# EAGLE schematic power electronics4 (EAGLE 9.2.2)
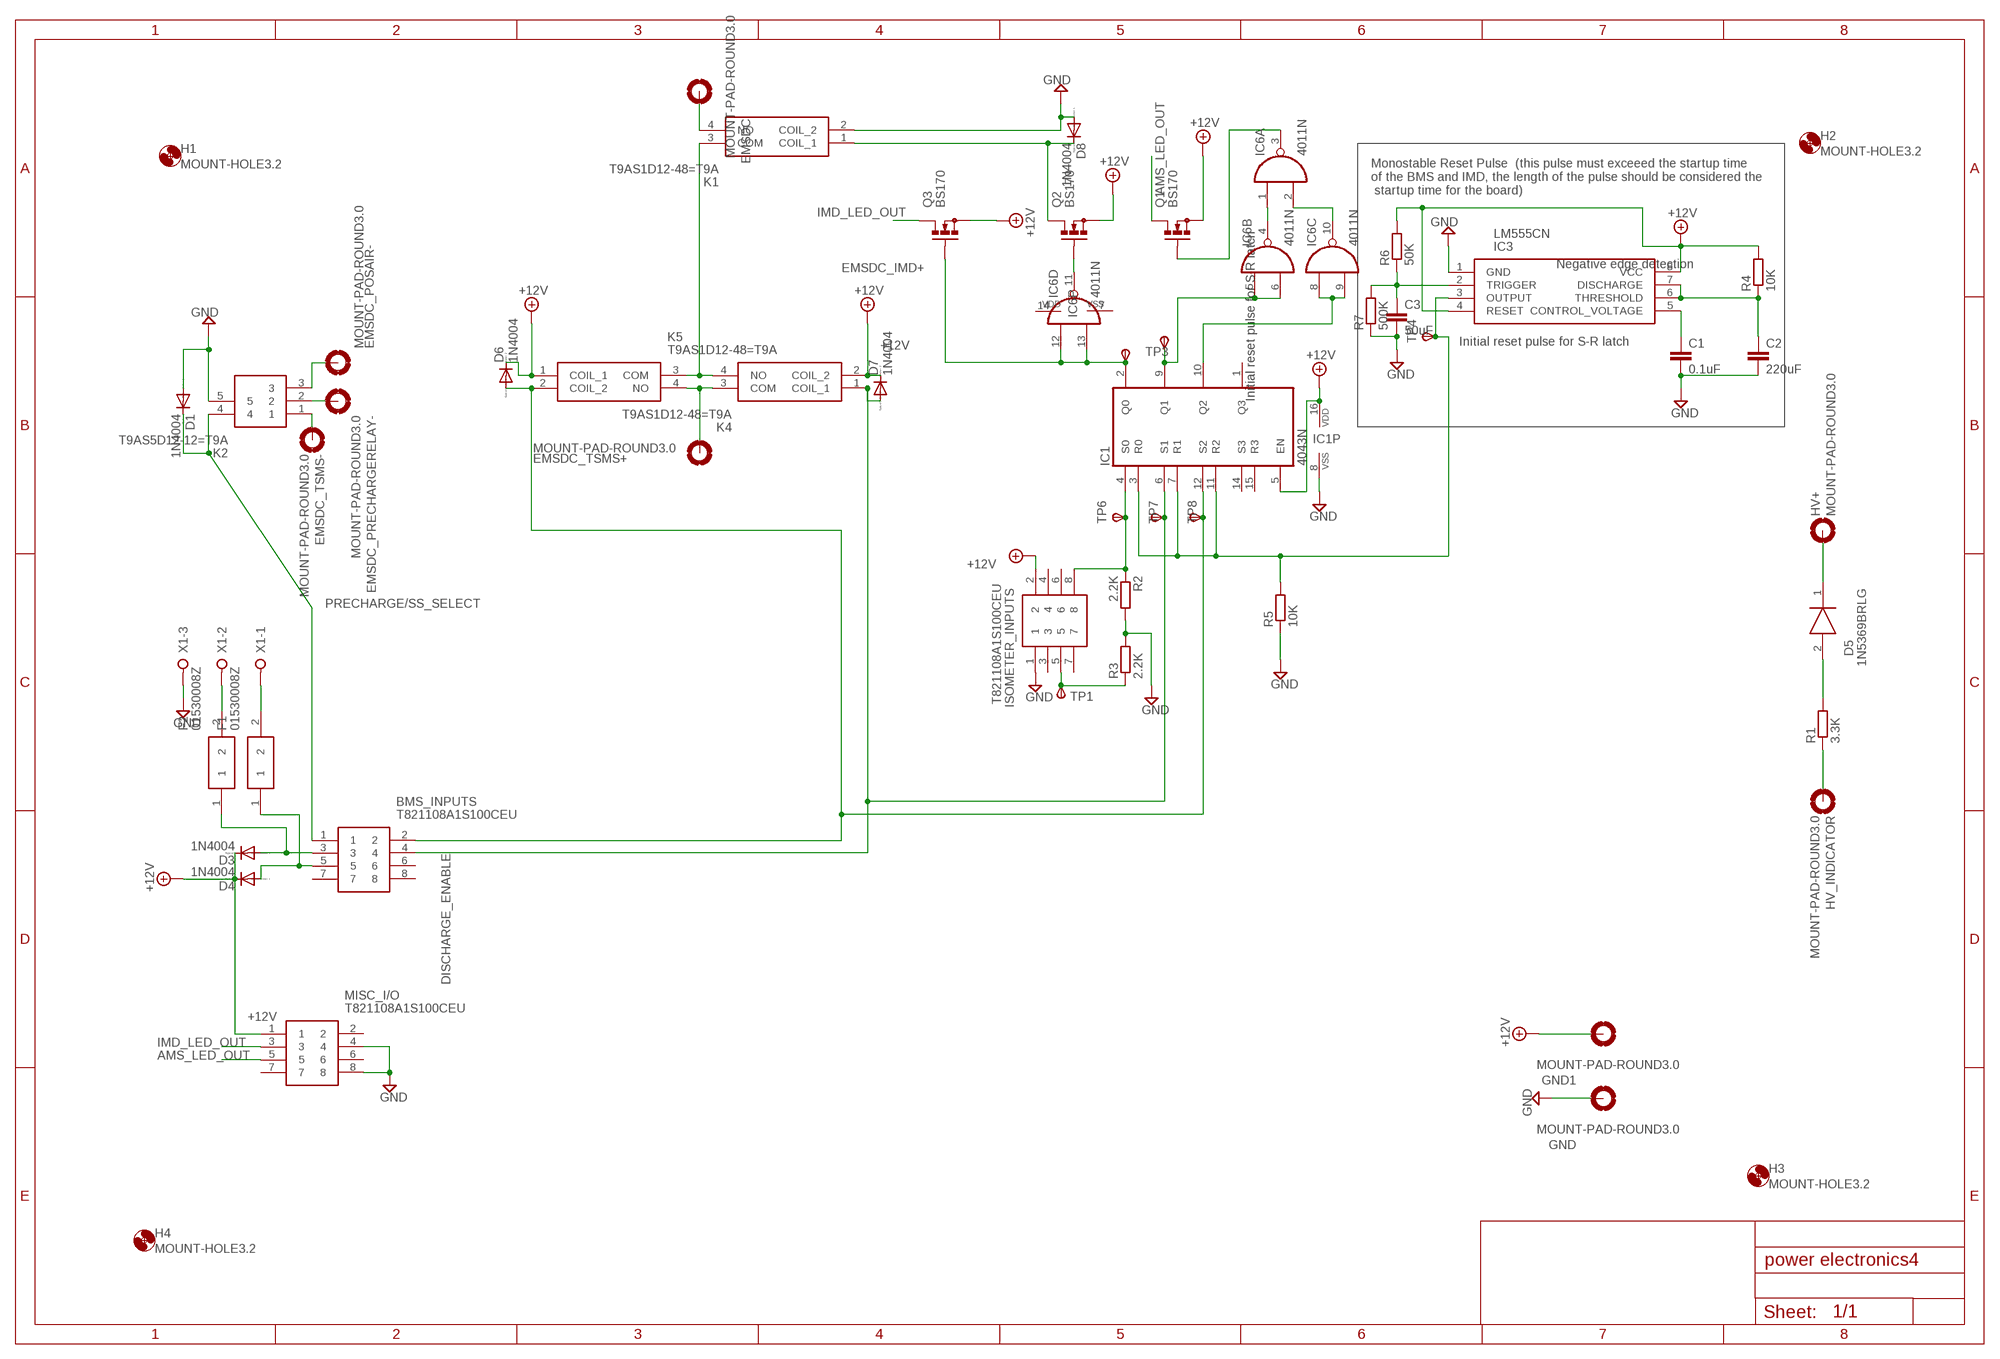
[diagram p0: schematic, sheet 1]

## Parts
BMS_INPUTS  T821108A1S100CEU  [HDRV8W64P254_2X4_1778X895X915P]
C1  0.1uF  C-EU050-024X044  [C050-024X044]
C2  220uF  C-EU050-024X044  [C050-024X044]
C3  50uF  C-EU050-024X044  [C050-024X044]
D1  1N4004  [DO41-10]
D3  1N4004  [DO41-10]
D4  1N4004  [DO41-10]
D5  1N5369BRLG  [DIOAD2260W109L864D349]
D6  1N4004  [DO41-10]
D7  1N4004  [DO41-10]
D8  1N4004  [DO41-10]
EMSDC  MOUNT-PAD-ROUND3.0  [3,0-PAD]
EMSDC_POSAIR-  MOUNT-PAD-ROUND3.0  [3,0-PAD]
EMSDC_PRECHARGERELAY-  MOUNT-PAD-ROUND3.0  [3,0-PAD]
EMSDC_TSMS+  MOUNT-PAD-ROUND3.0  [3,0-PAD]
EMSDC_TSMS-  MOUNT-PAD-ROUND3.0  [3,0-PAD]
F1  01530008Z  [01530008]
F2  01530008Z  [01530008]
GND  MOUNT-PAD-ROUND3.0  [3,0-PAD]
GND1  MOUNT-PAD-ROUND3.0  [3,0-PAD]
H1  MOUNT-HOLE3.2  [3,2]
H2  MOUNT-HOLE3.2  [3,2]
H3  MOUNT-HOLE3.2  [3,2]
H4  MOUNT-HOLE3.2  [3,2]
HV+  MOUNT-PAD-ROUND3.0  [3,0-PAD]
HV_INDICATOR  MOUNT-PAD-ROUND3.0  [3,0-PAD]
IC1  4043N  [DIL16]
IC3  LM555CN  [DIP762W53P254L980H533Q8N]
IC6  4011N  [DIL14]
ISOMETER_INPUTS  T821108A1S100CEU  [HDRV8W64P254_2X4_1778X895X915P]
K1  T9AS1D12-48=T9A  [T9AS1D1248T9A]
K2  T9AS5D12-12=T9A  [T9AS1D12]
K4  T9AS1D12-48=T9A  [T9AS1D1248T9A]
K5  T9AS1D12-48=T9A  [T9AS1D1248T9A]
MISC_I/O  T821108A1S100CEU  [HDRV8W64P254_2X4_1778X895X915P]
Q1  BS170  [SOT54E]
Q2  BS170  [SOT54E]
Q3  BS170  [SOT54E]
R1  3.3K  R-EU_0207/15  [0207/15]
R2  2.2K  R-EU_0207/12  [0207/12]
R3  2.2K  R-EU_0207/12  [0207/12]
R4  10K  R-EU_0207/15  [0207/15]
R5  10K  R-EU_0207/15  [0207/15]
R6  50K  R-EU_0207/15  [0207/15]
R7  500K  R-EU_0207/15  [0207/15]
TP1  TPSPAD1-17  [P1-17]
TP2  TPSPAD1-17  [P1-17]
TP3  TPSPAD1-17  [P1-17]
TP4  TPSPAD1-17  [P1-17]
TP6  TPSPAD1-17  [P1-17]
TP7  TPSPAD1-17  [P1-17]
TP8  TPSPAD1-17  [P1-17]
X1  W237-3E  [W237-3E]

## Nets
+12V: D3.C D4.C D6.C D7.C GND1.B3,0(MOUNT) IC1.5(EN) IC1.16(VDD) IC3.4(RESET) IC3.8(VCC) ISOMETER_INPUTS.2 K4.2(COIL_2) K5.1(COIL_1) MISC_I/O.1 Q1.S Q2.S Q3.S R4.2 R6.2
AMS_LED_OUT: MISC_I/O.5 Q1.D
CHG_SAFE: BMS_INPUTS.2 D6.A IC1.12(S2) K5.2(COIL_2) TP8.TP(PP)
DISCHARGE_ENABLE: BMS_INPUTS.4 D7.A IC1.6(S1) K4.1(COIL_1) TP7.TP(PP)
EMSDC_IMD+: K1.3(COM) K4.4(NO) K5.3(COM)
GND: C1.2 C2.2 C3.2 D1.A D8.A GND.B3,0(MOUNT) IC1.8(VSS) IC3.1(GND) ISOMETER_INPUTS.1 K1.2(COIL_2) K2.5 MISC_I/O.4 MISC_I/O.8 R2.2 R3.2 R5.1 R7.1 X1.3
IMD_LED_OUT: MISC_I/O.3 Q3.D
N$1: EMSDC_TSMS-.B3,0(MOUNT) K2.1
N$2: EMSDC_POSAIR-.B3,0(MOUNT) K2.3
N$3: EMSDC_PRECHARGERELAY-.B3,0(MOUNT) K2.2
N$4: EMSDC_TSMS+.B3,0(MOUNT) K4.3(COM) K5.4(NO)
N$5: D5.1(K) HV+.B3,0(MOUNT)
N$6: BMS_INPUTS.3 D3.A F2.1
N$7: D5.2(A) R1.2
N$8: BMS_INPUTS.5 D4.A F1.1
N$9: HV_INDICATOR.B3,0(MOUNT) R1.1
N$10: ISOMETER_INPUTS.5 R3.1 TP1.TP(PP)
N$11: IC1.3(R0) IC1.7(R1) IC1.11(R2) IC3.3(OUTPUT) R5.2 TP4.TP(PP)
N$12: IC1.9(Q1) IC6.5(B:I0) IC6.6(B:I1) TP3.TP(PP)
N$13: IC1.10(Q2) IC6.8(C:I0) IC6.9(C:I1)
N$14: IC6.1(A:I0) IC6.4(B:O)
N$15: D8.C K1.1(COIL_1) Q2.D
N$16: EMSDC.B3,0(MOUNT) K1.4(NO)
N$17: IC1.4(S0) ISOMETER_INPUTS.8 R2.1 TP6.TP(PP)
N$18: C2.1 IC3.6(THRESHOLD) IC3.7(DISCHARGE) R4.1
N$19: C1.1 IC3.5(CONTROL_VOLTAGE)
N$20: IC6.2(A:I1) IC6.10(C:O)
N$21: IC6.3(A:O) Q1.G
N$22: C3.1 IC3.2(TRIGGER) R6.1 R7.2
N$31: F2.2 X1.2
N$33: F1.2 X1.1
N$35: IC1.2(Q0) IC6.12(D:I0) IC6.13(D:I1) Q3.G TP2.TP(PP)
N$37: IC6.11(D:O) Q2.G
PRECHARGE/SS_SELECT: BMS_INPUTS.1 D1.C K2.4
Unconnected: BMS_INPUTS.6 BMS_INPUTS.7 BMS_INPUTS.8 IC1.1(Q3) IC1.14(S3) IC1.15(R3) ISOMETER_INPUTS.3 ISOMETER_INPUTS.4 ISOMETER_INPUTS.6 ISOMETER_INPUTS.7 MISC_I/O.2 MISC_I/O.6 MISC_I/O.7

## Notes on the sheet
- Monostable Reset Pulse  (this pulse must exceeed the startup time 
  of the BMS and IMD, the length of the pulse should be considered the
   startup time for the board)
- Negative edge detection
- Initial reset pulse for S-R latch
- Initial reset pulse for S-R latch

## Power pins joined to a net without a drawn wire
VDD: IC6.14(P:VDD)
VSS: IC6.7(P:VSS)

## Library data of the parts
BMS_INPUTS ISOMETER_INPUTS MISC_I/O = SamacSys_Parts:T821108A1S100CEU: HEADER, VERTICAL, 2.54MM, 8WAY Amphenol T821 Series, 2.54mm Pitch 8 Way 2 Row Straight PCB Header, Solder Termination, 3A Source: Datasheet <http://uk.rs-online.com/web/p/products/8323569>; DESCRIPTION: HEADER, VERTICAL, 2.54MM, 8WAY Amphenol T821 Series, 2.54mm Pitch 8 Way 2 Row Straight PCB Header, Solder Termination, 3A; HEIGHT: 9.15mm; MANUFACTURER_NAME: Amphenol; MANUFACTURER_PART_NUMBER: T821108A1S100CEU; RS_PART_NUMBER: 8323569; RS_PRICE-STOCK: http://uk.rs-online.com/web/p/products/8323569
C1-C3 = rcl:C-EU: CAPACITOR, European symbol; SPICEPREFIX: C
D1 D3 D4 D6-D8 = diode:1N4004: DIODE general purpose rectifier, 1 A
D5 = SamacSys_Parts:1N5369BRLG: Zener Diode, 51V 5% 5 W Through Hole 2-pin DO-15 Source: Datasheet <http://uk.rs-online.com/web/p/products/6547678P>; ALLIED_NUMBER: 70339233; DESCRIPTION: Zener Diode, 51V 5% 5 W Through Hole 2-pin DO-15; HEIGHT: mm; MANUFACTURER_NAME: ON Semiconductor; MANUFACTURER_PART_NUMBER: 1N5369BRLG; RS_PART_NUMBER: 6547678P; RS_PRICE-STOCK: http://uk.rs-online.com/web/p/products/6547678P
EMSDC EMSDC_POSAIR- EMSDC_PRECHARGERELAY- EMSDC_TSMS+ EMSDC_TSMS- GND GND1 HV+ HV_INDICATOR = holes:MOUNT-PAD-ROUND: MOUNTING PAD, round
F1 F2 = SamacSys_Parts:01530008Z: Mini fuseholder,15A 32V Littelfuse 15A PCB Mount Fuse Holder Automotive Fuse, 32 V Source: Datasheet <http://www.littelfuse.com/data/en/data_sheets/153_pcmount.pdf>; ALLIED_NUMBER: 70184304; DESCRIPTION: Mini fuseholder,15A 32V Littelfuse 15A PCB Mount Fuse Holder Automotive Fuse, 32 V; HEIGHT: mm; MANUFACTURER_NAME: LITTELFUSE; MANUFACTURER_PART_NUMBER: 01530008Z; RS_PART_NUMBER: 3607317; RS_PRICE-STOCK: https://uk.rs-online.com/web/p/products/3607317
H1-H4 = holes:MOUNT-HOLE: MOUNTING HOLE with drill center marker
IC1 = 40xx:4043: Quad 3-state NOR R/S LATCH
IC3 = SamacSys_Parts:LM555CN: ON Semiconductor LM555CN, Timer, 4.5 16 V, 8-Pin PDIP Source: Datasheet <https://www.mouser.com/datasheet/2/308/LM555-1124984.pdf>; DESCRIPTION: ON Semiconductor LM555CN, Timer, 4.5 16 V, 8-Pin PDIP; HEIGHT: 5.33mm; MANUFACTURER_NAME: ON Semiconductor; MANUFACTURER_PART_NUMBER: LM555CN; MOUSER_PART_NUMBER: 512-LM555CN
IC6 = 40xx:4011: Quad 2-input NAND
K1 K4 K5 = SamacSys_Parts:T9AS1D12-48=T9A: SPST-NO PCB Mount Non-Latching Relay Through Hole, 48V dc Source: Datasheet <http://uk.rs-online.com/web/p/products/6802534P>; DESCRIPTION: SPST-NO PCB Mount Non-Latching Relay Through Hole, 48V dc; HEIGHT: 20.4mm; MANUFACTURER_NAME: TE Connectivity; MANUFACTURER_PART_NUMBER: T9AS1D12-48=T9A; RS_PART_NUMBER: 6802534P; RS_PRICE-STOCK: http://uk.rs-online.com/web/p/products/6802534P
K2 = SamacSys_Parts:T9AS5D12-12=T9A: PCB Relay SPDT 30A 12Vdc,thru hole SPDT PCB Mount Non-Latching Relay Through Hole, 12V dc Source: Datasheet; ALLIED_NUMBER: R1111589; DESCRIPTION: PCB Relay SPDT 30A 12Vdc,thru hole SPDT PCB Mount Non-Latching Relay Through Hole, 12V dc; HEIGHT: mm; MANUFACTURER_NAME: TE Connectivity; MANUFACTURER_PART_NUMBER: T9AS5D12-12=T9A; RS_PART_NUMBER: 6802528; RS_PRICE-STOCK: https://uk.rs-online.com/web/p/products/6802528
Q1-Q3 = transistor-small-signal:BS170: N-CHANNEL MOS FET
R1-R7 = rcl:R-EU_: RESISTOR, European symbol; SPICEPREFIX: R
TP1-TP4 TP6-TP8 = testpad:TPS: TEST PIN
X1 = con-wago-508:W237-3E: WAGO SREW CLAMP; OC_FARNELL: unknown; OC_NEWARK: unknown